# Altium schematic sheet pca10156_sheet1_connections.SchDoc: =BoardTitle+' - Connections'
size A3; Organization: Nordic Semiconductor; DocumentNumber: 1; SheetNumber: 1; SheetTotal: 7; CompanyName: Nordic Semiconductor; DocumentSize: A4
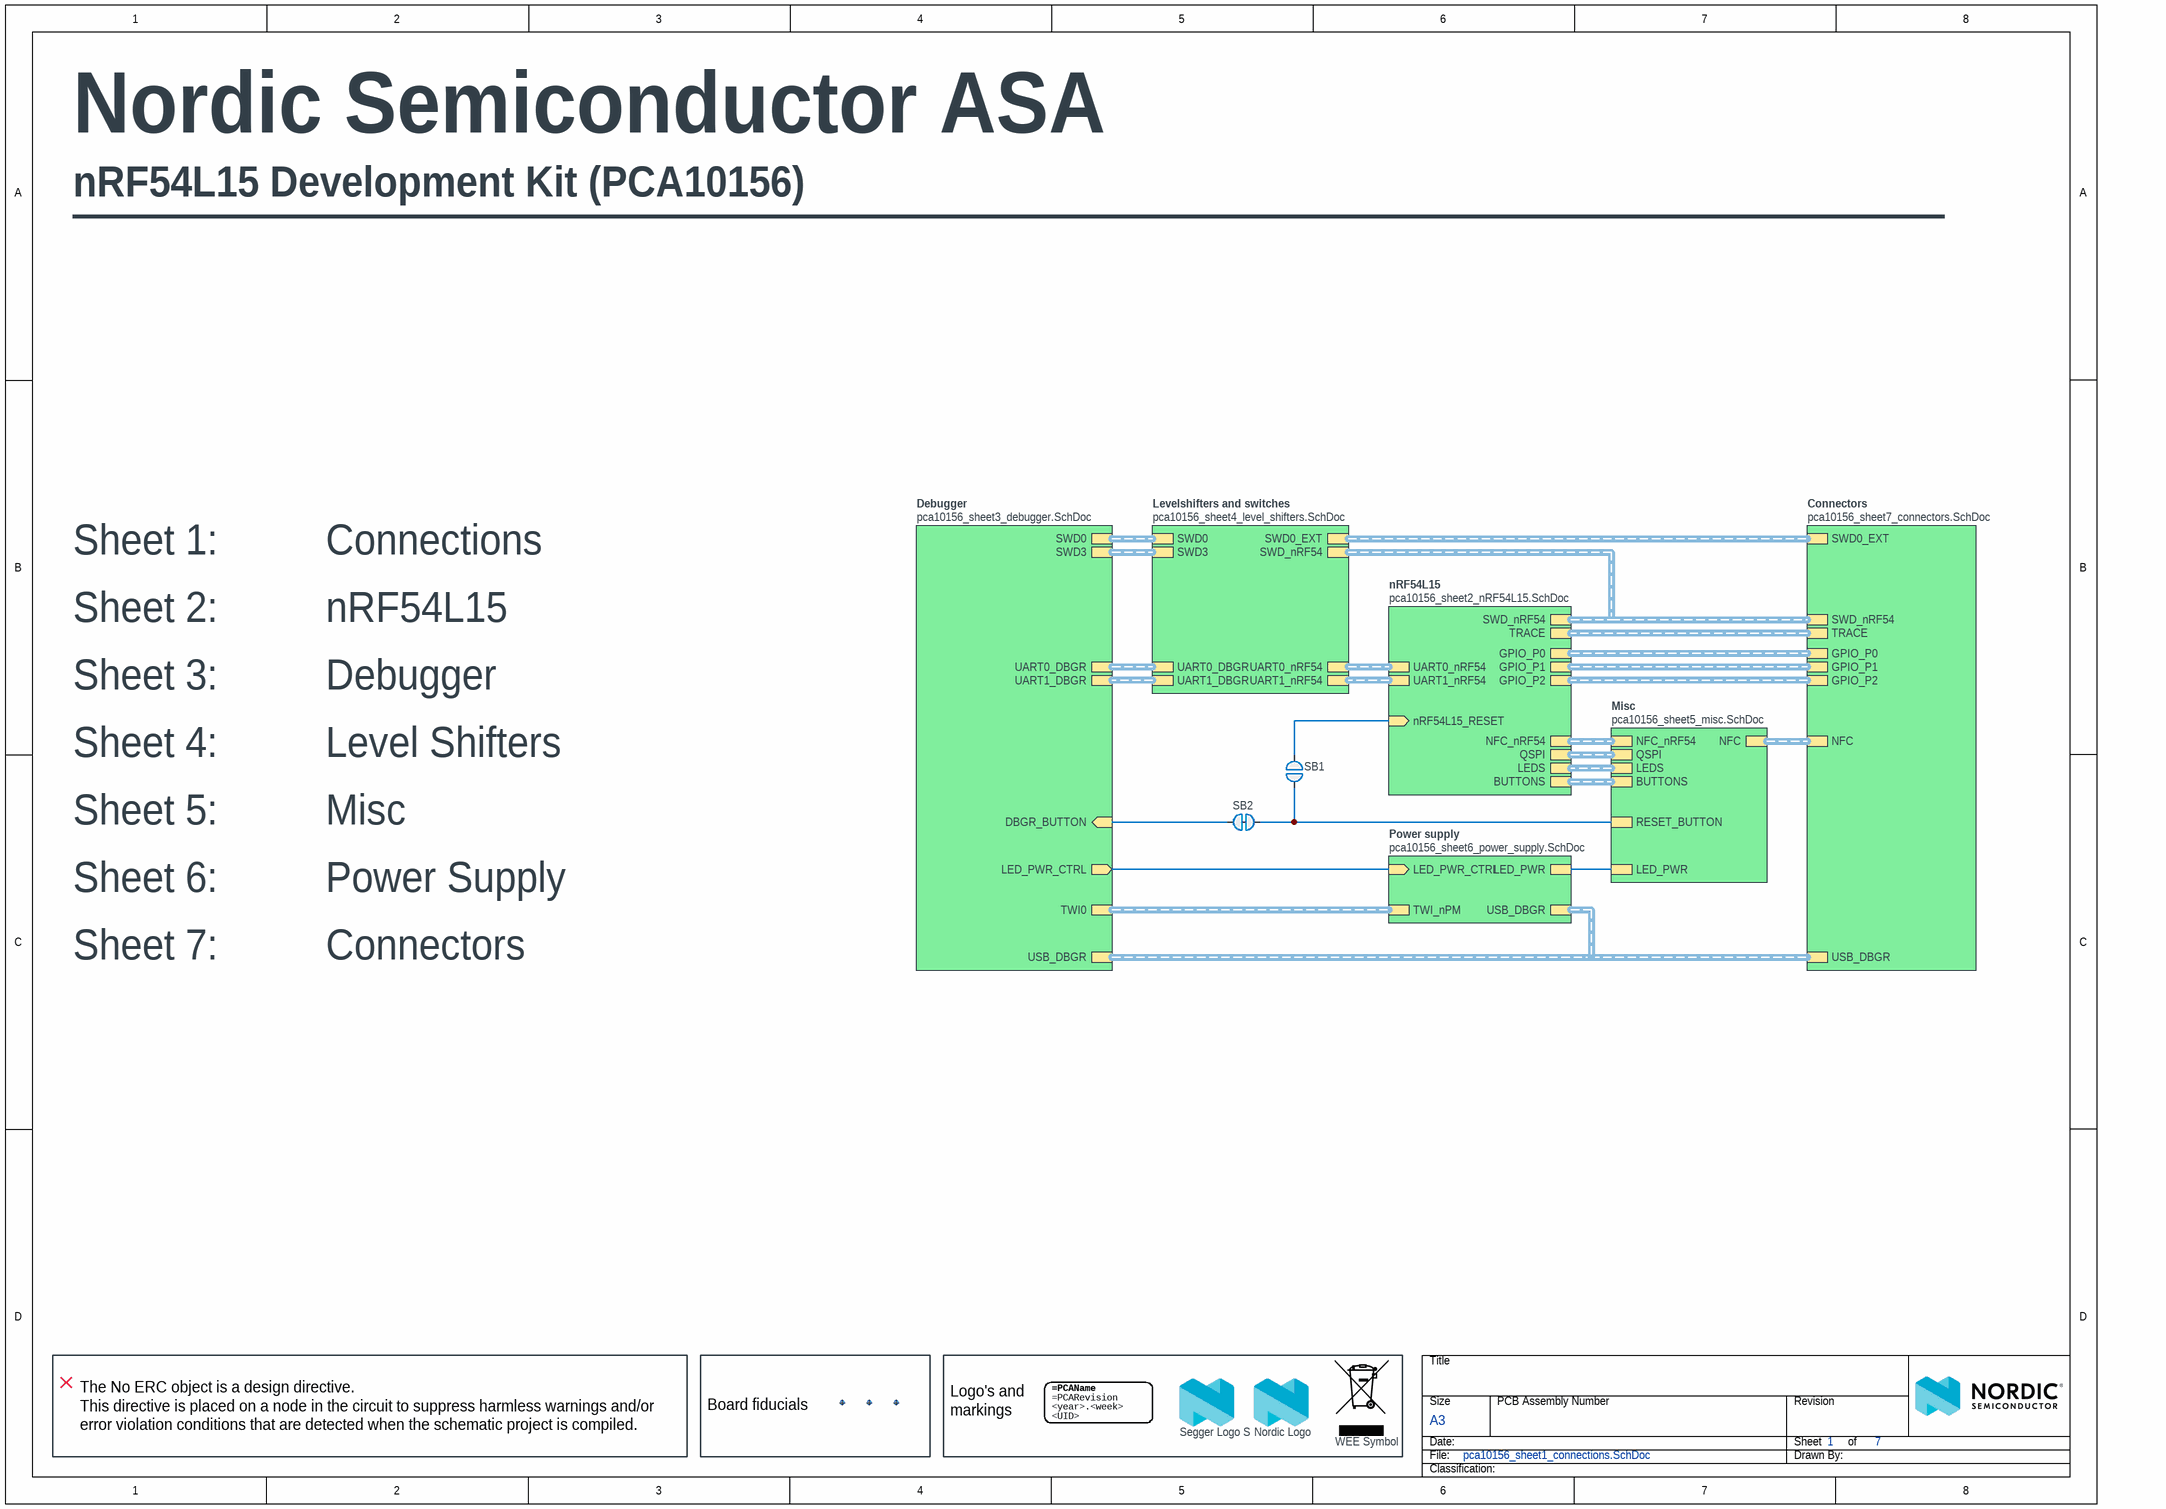
[diagram p0: pca10156_sheet1_connections.SchDoc]

## Parts
Fid1  Fiducial mark  [Fiducial]  (value not drawn)
Fid2  Fiducial mark  [Fiducial]  (value not drawn)
Fid3  Fiducial mark  [Fiducial]  (value not drawn)
LABEL1  12x12mm  [LabelSilk_12x12]  (value not drawn)
LOGO1  Nordic Logo  [NORDIC_LOGO_LYING]  (no BOM)
LOGO2  WEE Symbol  [WEE_3x4.5mm]  (no BOM)
LOGO3  Segger Logo S  [SEGGER_LOGO_S]  (no BOM)
SB1  Solderbridge  [Solderbridge]  (value not drawn)  (no BOM)
SB2  Solderbridge  [Solderbridge_Shorted]  (value not drawn)  (net tie, no BOM)

## Sub-sheets
Connectors = pca10156_sheet7_connectors.SchDoc: SWD_nRF54 (harness SWD), TRACE (harness TRACE), NFC (harness NFC), SWD0_EXT (harness SWD), GPIO_P0 (harness GPIO_P0), GPIO_P1 (harness GPIO_P1), GPIO_P2 (harness GPIO_P2), USB_DBGR (harness USB)
Debugger = pca10156_sheet3_debugger.SchDoc: DBGR_BUTTON (in), SWD0 (harness SWD), UART0_DBGR (harness UART_IMCU), USB_DBGR (harness USB), UART1_DBGR (harness UART_IMCU), TWI0 (harness TWI), SWD3 (harness SWD), LED_PWR_CTRL (out)
Levelshifters and switches = pca10156_sheet4_level_shifters.SchDoc: SWD0 (harness SWD), SWD0_EXT (harness SWD), UART0_nRF54 (harness UART), UART1_nRF54 (harness UART), SWD3 (harness SWD), SWD_nRF54 (harness SWD), UART0_DBGR (harness UART_IMCU), UART1_DBGR (harness UART_IMCU)
Misc = pca10156_sheet5_misc.SchDoc: NFC_nRF54 (harness NFC), NFC (harness NFC), BUTTONS (harness UI), LEDS (harness UI), RESET_BUTTON, QSPI (harness QSPI), LED_PWR
nRF54L15 = pca10156_sheet2_nRF54L15.SchDoc: BUTTONS (harness UI), LEDS (harness UI), TRACE (harness TRACE), NFC_nRF54 (harness NFC), GPIO_P0 (harness GPIO_P0), UART0_nRF54 (harness UART), GPIO_P1 (harness GPIO_P1), GPIO_P2 (harness GPIO_P2), UART1_nRF54 (harness UART), SWD_nRF54 (harness SWD), QSPI (harness QSPI), nRF54L15_RESET (in)
Power supply = pca10156_sheet6_power_supply.SchDoc: TWI_nPM (harness TWI), LED_PWR_CTRL (in), LED_PWR, USB_DBGR (harness USB)

## Nets
NetSB1_1: SB1.1 ; sheet nRF54L15/nRF54L15_RESET
NetSB1_2: SB1.2 SB2.1 ; sheet Misc/RESET_BUTTON
NetSB2_2: SB2.2 ; sheet Debugger/DBGR_BUTTON
(unnamed): sheet Debugger/LED_PWR_CTRL, sheet Power supply/LED_PWR_CTRL
(unnamed): sheet Misc/LED_PWR, sheet Power supply/LED_PWR

## Buses and harness runs
harness sheet Connectors/GPIO_P0 = sheet nRF54L15/GPIO_P0
harness sheet Connectors/GPIO_P1 = sheet nRF54L15/GPIO_P1
harness sheet Connectors/GPIO_P2 = sheet nRF54L15/GPIO_P2
harness sheet Connectors/NFC = sheet Misc/NFC
harness sheet Connectors/SWD0_EXT = sheet Levelshifters and switches/SWD0_EXT
harness sheet Connectors/SWD_nRF54 = sheet Levelshifters and switches/SWD_nRF54 = sheet nRF54L15/SWD_nRF54
harness sheet Connectors/TRACE = sheet nRF54L15/TRACE
harness sheet Connectors/USB_DBGR = sheet Debugger/USB_DBGR = sheet Power supply/USB_DBGR
harness sheet Debugger/SWD0 = sheet Levelshifters and switches/SWD0
harness sheet Debugger/SWD3 = sheet Levelshifters and switches/SWD3
harness sheet Debugger/TWI0 = sheet Power supply/TWI_nPM
harness sheet Debugger/UART0_DBGR = sheet Levelshifters and switches/UART0_DBGR
harness sheet Debugger/UART1_DBGR = sheet Levelshifters and switches/UART1_DBGR
harness sheet Levelshifters and switches/UART0_nRF54 = sheet nRF54L15/UART0_nRF54
harness sheet Levelshifters and switches/UART1_nRF54 = sheet nRF54L15/UART1_nRF54
harness sheet Misc/BUTTONS = sheet nRF54L15/BUTTONS
harness sheet Misc/LEDS = sheet nRF54L15/LEDS
harness sheet Misc/NFC_nRF54 = sheet nRF54L15/NFC_nRF54
harness sheet Misc/QSPI = sheet nRF54L15/QSPI

## Notes on the sheet
- Nordic Semiconductor ASA
- nRF54L15 Development Kit (PCA10156)
- ________________________________________________________________
- Sheet 1:          Connections
- Sheet 2:          nRF54L15
- Sheet 3:          Debugger
- Sheet 4:          Level Shifters
- Sheet 5:          Misc
- Sheet 6:          Power Supply
- Sheet 7:          Connectors
- The No ERC object is a design directive.
  This directive is placed on a node in the circuit to suppress harmless warnings and/or error violation conditions that are detected when the schematic project is compiled.
- (near Fid1) Board fiducials
- (near LABEL1) Logo's and markings
- Title
- Size
- Date:
- File:
- A3
- PCB Assembly Number
- Sheet
- Drawn By:
- Revision
- of
- Classification:
- (in symbol Label_12x12) <year>.<week>; <UID>

## Library data of the parts
Fid1-Fid3 = Fid-Mark: Manufacturer: N.A.; Part number NEMS: 100500073; Value: N.A.; Pad Count: 1; Component Status: Active; System: Connector; Part Number: Fid-Mark; Manufacturer Part Number: N.A.; LatestRevisionDate: 2009-12-12; Published: 2009-12-12; Note: N.A.; Artikkelnr Noca: N.A.; Footprint Doc: Fiducial; Part number IPS: N.A.; ComponentLink1URL: N.A.; ComponentLink1Description: Datasheet; ComponentLink2URL: N.A.; ComponentLink2Description: Supplier link; HelpURL: N.A.; Supplier 1: N.A.; Supplier Part Number 1: N.A.; Supplier 2: N.A.; Supplier Part Number 2: N.A.; PartId: 100500073; Component Class: Connectors; Author: rsk; Part number Norautron: N.A.
LABEL1 = Label_12x12: PCA version label, stick-on, 12x12mm; Manufacturer: Ellco Etikett; Manufacturer Part Number: A33512‐01; Part number NEMS: 101200028; Component Status: Active; Pad Count: 0; Note: N.A.; Part Number: Label_12x12; PartId: 101200028; Component Class: Mechanicals; Author: hany; ComponentLink1URL: N.A.; ComponentLink1Description: Datasheet; ComponentLink2URL: N.A.; ComponentLink2Description: Supplier link; HelpURL: N.A.; LatestRevisionDate: 2023-01-05; Published: 2023-01-05; Footprint Doc: Label; Value: 12x12mm; Supplier 1: N.A.; Supplier Part Number 1: N.A.; Supplier 2: N.A.; Supplier Part Number 2: N.A.; Artikkelnr Noca: N.A.; Part number IPS: N.A.; Part number Norautron: N.A.
LOGO1 = Nordic Logo lying: Manufacturer: N.A.; Part number NEMS: 101100001; Component Status: Active; Pad Count: 0; Part Number: Nordic Logo lying; PartId: 101100001; Component Class: Markings; Author: rsk; Manufacturer Part Number: N.A.; ComponentLink1URL: N.A.; ComponentLink1Description: Datasheet; ComponentLink2URL: N.A.; ComponentLink2Description: Supplier link; HelpURL: N.A.; LatestRevisionDate: 2017-03-20; Published: 2017-09-01; Footprint Doc: Nordic Logo; Value: Nordic Logo; Note: N.A.; Supplier 1: N.A.; Supplier Part Number 1: N.A.; Supplier 2: N.A.; Supplier Part Number 2: N.A.; Artikkelnr Noca: N.A.; Part number IPS: N.A.; Part number Norautron: N.A.
LOGO2 = WEEE Symbol 3x4.5mm: WEEE Directive symbol; Manufacturer: N.A.; Part number NEMS: 101100006; Component Status: Active; Pad Count: 0; Part Number: WEEE Symbol 3x4.5mm; PartId: 101100006; Component Class: Markings; Author: rsk; Manufacturer Part Number: N.A.; ComponentLink1URL: N.A.; ComponentLink1Description: Datasheet; ComponentLink2URL: N.A.; ComponentLink2Description: Supplier link; HelpURL: N.A.; LatestRevisionDate: 2023-03-07; Published: 2016-09-07; Footprint Doc: WEE_3x4.5mm; Value: WEE Symbol; Note: N.A.; Supplier 1: N.A.; Supplier Part Number 1: N.A.; Supplier 2: N.A.; Supplier Part Number 2: N.A.; Artikkelnr Noca: N.A.; Part number IPS: N.A.; Part number Norautron: N.A.
LOGO3 = Segger Logo S: Segger logo, small size; Manufacturer: N.A.; Part number NEMS: 101100004; Component Status: Active; Pad Count: 0; Part Number: Segger Logo S; PartId: 101100004; Component Class: Markings; Author: rsk; Manufacturer Part Number: N.A.; ComponentLink1URL: N.A.; ComponentLink1Description: Datasheet; ComponentLink2URL: N.A.; ComponentLink2Description: Supplier link; HelpURL: N.A.; LatestRevisionDate: 2016-09-07; Published: 2016-09-07; Footprint Doc: Segger Logo S; Value: Segger Logo S; Note: N.A.; Supplier 1: N.A.; Supplier Part Number 1: N.A.; Supplier 2: N.A.; Supplier Part Number 2: N.A.; Artikkelnr Noca: N.A.; Part number IPS: N.A.; Part number Norautron: N.A.
SB1 = Solderbridge: Manufacturer: N.A.; Part number NEMS: 100500458; Pad Count: 2; Component Status: Active; System: Connector; Part Number: Solderbridge; Manufacturer Part Number: N.A.; LatestRevisionDate: 2009-12-14; Published: 2009-12-14; Value: Solderbridge; Note: N.A.; Artikkelnr Noca: N.A.; Footprint Doc: Solderbridge; Part number IPS: N.A.; ComponentLink1URL: N.A.; ComponentLink1Description: Datasheet; ComponentLink2URL: N.A.; ComponentLink2Description: Supplier link; HelpURL: N.A.; Supplier 1: N.A.; Supplier Part Number 1: N.A.; Supplier 2: N.A.; Supplier Part Number 2: N.A.; Component Class: Connectors; PartId: 100500458; Author: rsk; Part number Norautron: N.A.
SB2 = Solderbridge Shorted: Shorted Solderbridge; Manufacturer: N.A.; Part number NEMS: 100500459; Pad Count: 2; Component Status: Active; System: Connector; Part Number: Solderbridge Shorted; Manufacturer Part Number: N.A.; LatestRevisionDate: 2012-08-07; Published: 2012-08-07; Value: Solderbridge; Note: N.A.; Artikkelnr Noca: N.A.; Footprint Doc: Solderbridge_Shorted; Part number IPS: N.A.; ComponentLink1URL: N.A.; ComponentLink1Description: Datasheet; ComponentLink2URL: N.A.; ComponentLink2Description: Supplier link; HelpURL: N.A.; Supplier 1: N.A.; Supplier Part Number 1: N.A.; Supplier 2: N.A.; Supplier Part Number 2: N.A.; Component Class: Connectors; PartId: 100500459; Author: rsk; Part number Norautron: N.A.